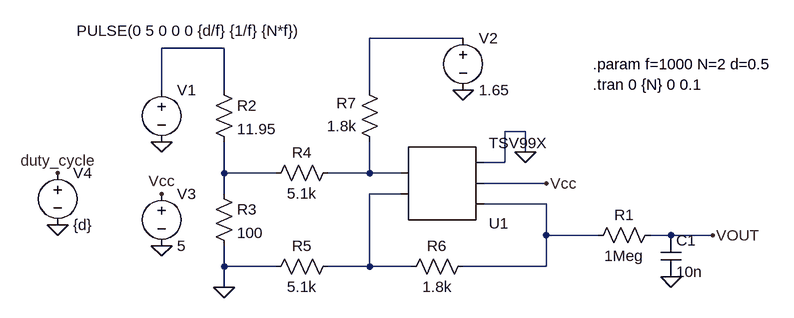
[diagram p0: schematic Draft1.asc]
Draft1.asc, the LTspice schematic file:
Version 4
SHEET 1 880 680
WIRE -288 -80 -432 -80
WIRE -656 -64 -752 -64
WIRE -752 0 -752 -64
WIRE -656 0 -656 -64
WIRE -432 0 -432 -80
WIRE -192 64 -224 64
WIRE -192 96 -192 64
WIRE -224 112 -224 64
WIRE -224 112 -256 112
WIRE -656 128 -656 80
WIRE -576 128 -656 128
WIRE -432 128 -432 80
WIRE -432 128 -496 128
WIRE -384 128 -432 128
WIRE -160 144 -256 144
WIRE -656 160 -656 128
WIRE -384 160 -432 160
WIRE -160 176 -256 176
WIRE -160 224 -160 176
WIRE -80 224 -160 224
WIRE 32 224 0 224
WIRE 96 224 32 224
WIRE -656 272 -656 240
WIRE -576 272 -656 272
WIRE -432 272 -432 160
WIRE -432 272 -496 272
WIRE -368 272 -432 272
WIRE -160 272 -160 224
WIRE -160 272 -288 272
WIRE -656 304 -656 272
FLAG 32 288 0
FLAG -752 80 0
FLAG 96 224 VOUT
FLAG -288 0 0
FLAG -192 96 0
FLAG -160 144 Vcc
FLAG -752 160 Vcc
FLAG -752 240 0
FLAG -656 304 0
FLAG -912 128 duty_cycle
FLAG -912 208 0
SYMBOL res 16 208 R90
WINDOW 0 0 56 VBottom 2
WINDOW 3 32 56 VTop 2
SYMATTR InstName R1
SYMATTR Value 1Meg
SYMBOL cap 16 224 R0
SYMATTR InstName C1
SYMATTR Value 10n
SYMBOL voltage -752 -16 R0
WINDOW 3 -131 -75 Left 2
WINDOW 123 0 0 Left 0
WINDOW 39 0 0 Left 0
SYMATTR InstName V1
SYMATTR Value PULSE(0 5 0 0 0 {d/f} {1/f} {N*f})
SYMBOL AutoGenerated\\TSV99X -320 144 M180
SYMATTR InstName U1
SYMBOL res -672 -16 R0
SYMATTR InstName R2
SYMATTR Value 11.95
SYMBOL res -672 144 R0
SYMATTR InstName R3
SYMATTR Value 100
SYMBOL res -480 112 R90
WINDOW 0 0 56 VBottom 2
WINDOW 3 32 56 VTop 2
SYMATTR InstName R4
SYMATTR Value 5.1k
SYMBOL res -480 256 R90
WINDOW 0 0 56 VBottom 2
WINDOW 3 32 56 VTop 2
SYMATTR InstName R5
SYMATTR Value 5.1k
SYMBOL res -272 256 R90
WINDOW 0 0 56 VBottom 2
WINDOW 3 32 56 VTop 2
SYMATTR InstName R6
SYMATTR Value 1.8k
SYMBOL res -416 96 R180
WINDOW 0 36 76 Left 2
WINDOW 3 36 40 Left 2
SYMATTR InstName R7
SYMATTR Value 1.8k
SYMBOL voltage -288 -96 R0
WINDOW 123 0 0 Left 0
WINDOW 39 0 0 Left 0
SYMATTR InstName V2
SYMATTR Value 1.65
SYMBOL voltage -752 144 R0
WINDOW 123 0 0 Left 0
WINDOW 39 0 0 Left 0
SYMATTR InstName V3
SYMATTR Value 5
SYMBOL voltage -912 112 R0
WINDOW 123 0 0 Left 0
WINDOW 39 0 0 Left 0
SYMATTR InstName V4
SYMATTR Value {d}
TEXT -88 -40 Left 2 !.param f=1000 N=2 d=0.5
TEXT -88 -8 Left 2 !.tran 0 {N} 0 0.1

The netlist it stands for:
* Draft1.asc
R1 VOUT N006 1Meg
C1 VOUT 0 10n
V1 N002 0 PULSE(0 5 0 0 0 {d/f} {1/f} {N*f})
* U1: TSV99X (symbol AutoGenerated\TSV99X not available, pins judged from their places): pin1=N005 pin2=N004 pin3=N006 pin4=Vcc pin5=0
R2 N002 N003 11.95
R3 N003 0 100
R4 N004 N003 5.1k
R5 N005 0 5.1k
R6 N006 N005 1.8k
R7 N004 N001 1.8k
V2 N001 0 1.65
V3 Vcc 0 5
V4 duty_cycle 0 {d}
.param f=1000 N=2 d=0.5
.tran 0 {N} 0 0.1
.backanno
.end